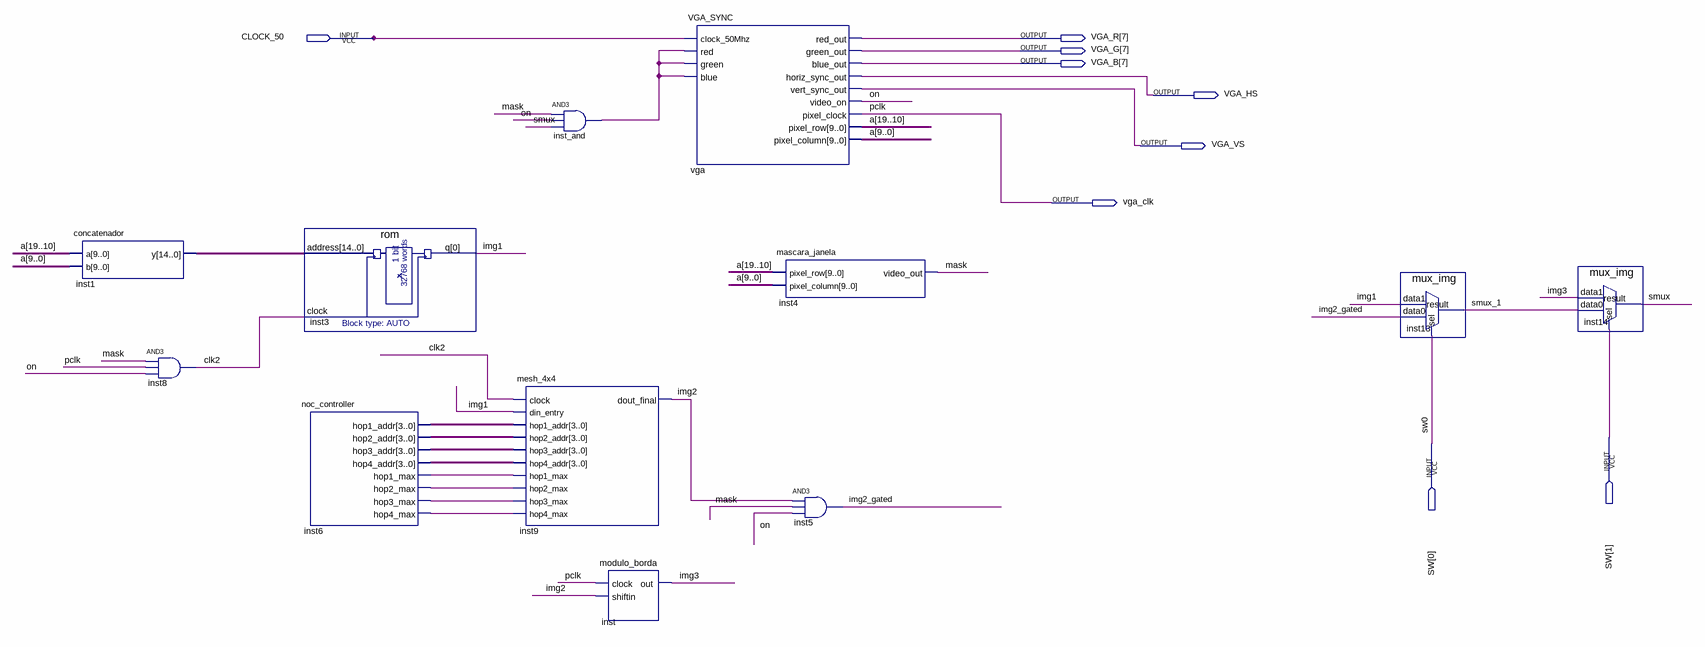
[diagram p0: schematic sheet]
// Quartus schematic vga_filtro.bdf as structural Verilog: 12 symbols, 9 pins
module vga_filtro (
  input  CLOCK_50,
  input  [1:0] SW,
  output [7:7] VGA_R,
  output [7:7] VGA_G,
  output [7:7] VGA_B,
  output VGA_HS,
  output VGA_VS,
  output vga_clk
);

  wire clk2, img1, img2, img2_gated, img3, inst6_hop1_max, inst6_hop2_max, inst6_hop3_max, inst6_hop4_max,
       inst_and_out, mask, on, smux, smux_1;
  wire [3:0] inst6_hop1_addr, inst6_hop2_addr, inst6_hop3_addr, inst6_hop4_addr;
  wire [14:0] inst1_y;
  wire [19:0] a;

  concatenador inst1 (.a(a[19:10]), .b(a[9:0]), .y(inst1_y));
  and inst8 (clk2, mask, vga_clk, on);
  rom inst3 (.address(inst1_y), .clock(clk2), .q(img1));
  noc_controller inst6 (
    .hop1_addr(inst6_hop1_addr), .hop2_addr(inst6_hop2_addr), .hop3_addr(inst6_hop3_addr),
    .hop4_addr(inst6_hop4_addr), .hop1_max(inst6_hop1_max), .hop2_max(inst6_hop2_max),
    .hop3_max(inst6_hop3_max), .hop4_max(inst6_hop4_max));
  and inst_and (inst_and_out, mask, on, smux);
  mesh_4x4 inst9 (
    .clock(clk2), .din_entry(img1), .hop1_addr(inst6_hop1_addr), .hop2_addr(inst6_hop2_addr),
    .hop3_addr(inst6_hop3_addr), .hop4_addr(inst6_hop4_addr), .hop1_max(inst6_hop1_max),
    .hop2_max(inst6_hop2_max), .hop3_max(inst6_hop3_max), .hop4_max(inst6_hop4_max), .dout_final(img2));
  modulo_borda inst (.clock(vga_clk), .shiftin(img2), .out(img3));
  VGA_SYNC vga (
    .clock_50Mhz(CLOCK_50), .red(inst_and_out), .green(inst_and_out), .blue(inst_and_out),
    .red_out(VGA_R[7]), .green_out(VGA_G[7]), .blue_out(VGA_B[7]), .horiz_sync_out(VGA_HS),
    .vert_sync_out(VGA_VS), .video_on(on), .pixel_clock(vga_clk), .pixel_row(a[19:10]), .pixel_column(a[9:0]));
  mascara_janela inst4 (.pixel_row(a[19:10]), .pixel_column(a[9:0]), .video_out(mask));
  and inst5 (img2_gated, img2, mask, on);
  mux_img inst13 (.data1(img1), .data0(img2_gated), .sel(SW[0]), .result(smux_1));
  mux_img inst14 (.data1(img3), .data0(smux_1), .sel(SW[1]), .result(smux));

  // Other names for the same wires on the sheet: pclk = vga_clk
endmodule
